# EAGLE schematic twomics_sw_led (EAGLE 7.7.0)
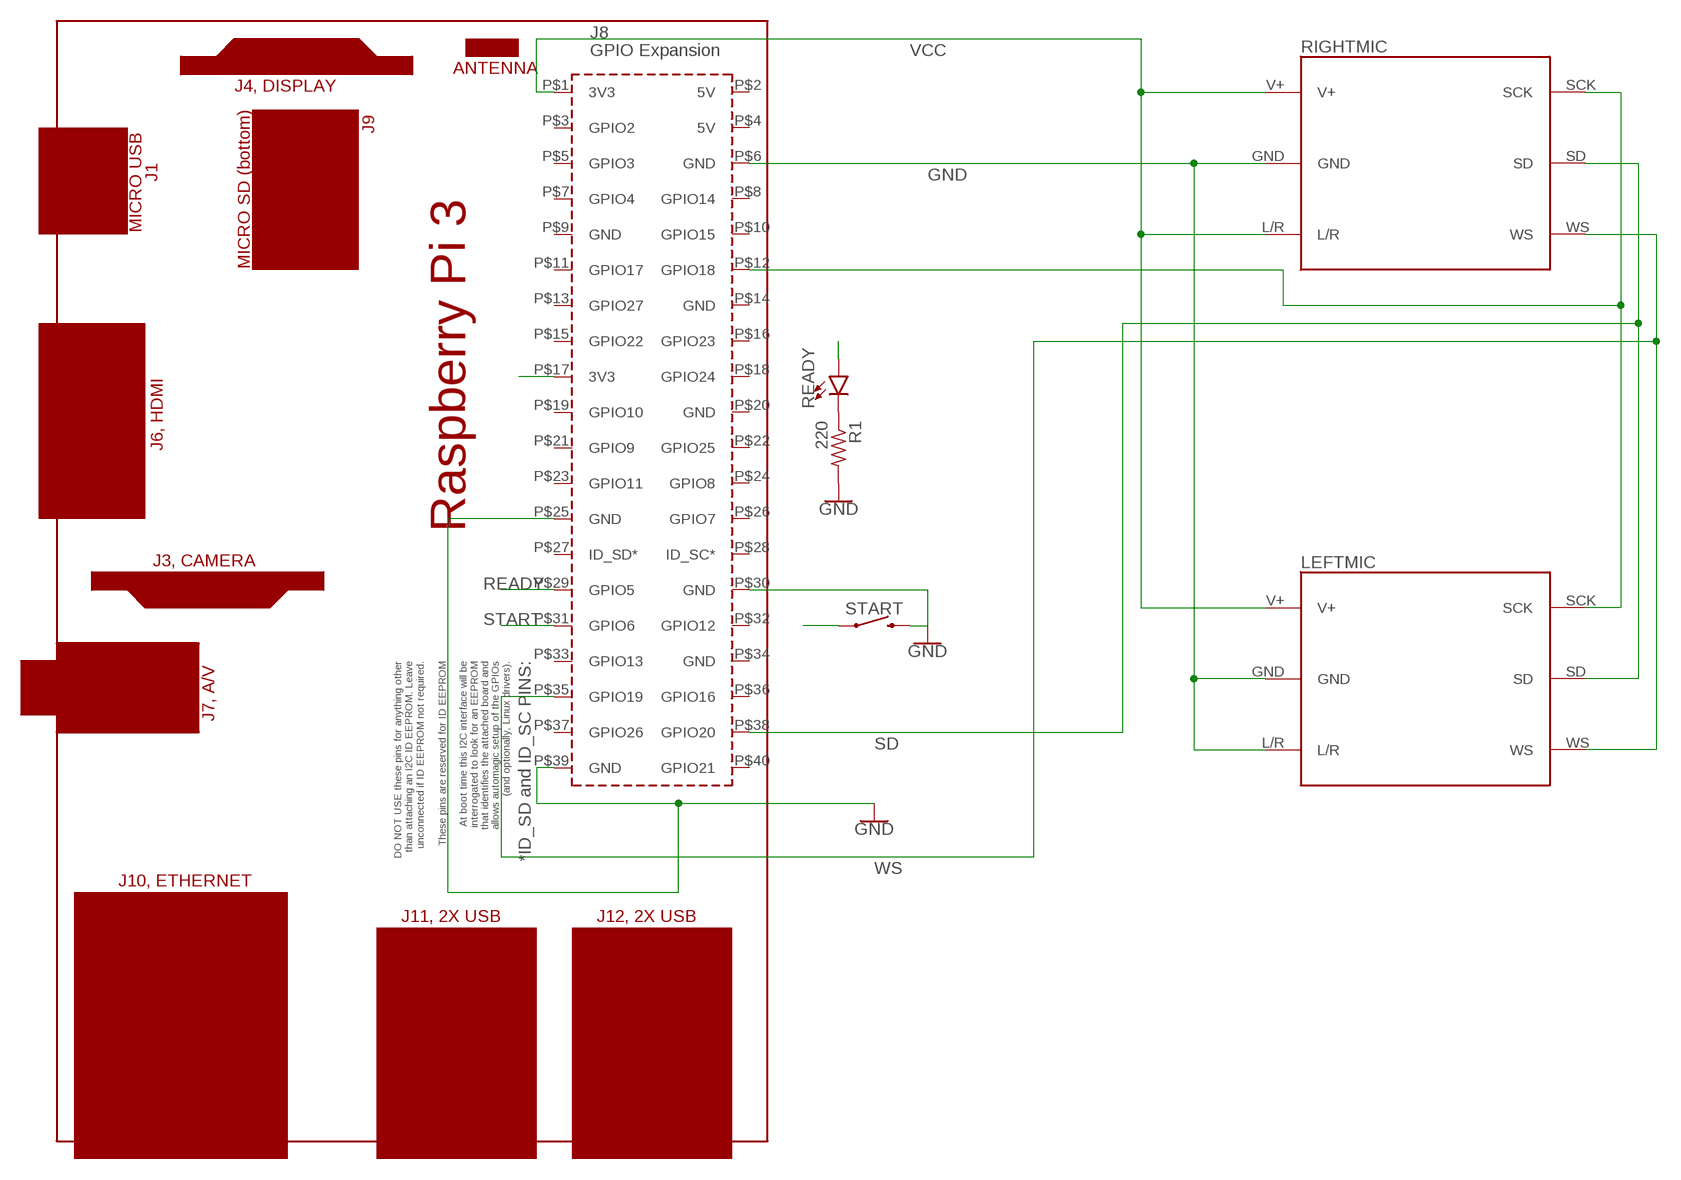
[diagram p0: schematic, sheet 1]

## Parts
LEFTMIC  EMMIC-ICS43432  [PTH]
PCB1  RPI3_40_PIN  [40_PIN]
R1  220  R-US_0207/7  [0207/7]
READY  LED3MM  [LED_3MM]
RIGHTMIC  EMMIC-ICS43432  [PTH]
START  MOMENTARY-SWITCH-SPST-PTH-6.0MM  [TACTILE_SWITCH_PTH_6.0MM]

## Nets
GND: LEFTMIC.GND LEFTMIC.L/R PCB1.P$6(GND) PCB1.P$25(GND) PCB1.P$30(GND) PCB1.P$39(GND) R1.2 RIGHTMIC.GND START.3
N$1: R1.1 READY.K(C)
READY: PCB1.P$29(GPIO5) READY.A
SCK: LEFTMIC.SCK PCB1.P$12(GPIO18) RIGHTMIC.SCK
SD: LEFTMIC.SD PCB1.P$38(GPIO20) RIGHTMIC.SD
START: PCB1.P$31(GPIO6) START.1
VCC: LEFTMIC.V+ PCB1.P$1(3V3) PCB1.P$17(3V3) RIGHTMIC.L/R RIGHTMIC.V+
WS: LEFTMIC.WS PCB1.P$35(GPIO19) RIGHTMIC.WS
Unconnected: PCB1.P$2(5V) PCB1.P$3(GPIO2) PCB1.P$4(5V) PCB1.P$5(GPIO3) PCB1.P$7(GPIO4) PCB1.P$8(GPIO14) PCB1.P$9(GND) PCB1.P$10(GPIO15) PCB1.P$11(GPIO17) PCB1.P$13(GPIO27) PCB1.P$14(GND) PCB1.P$15(GPIO22) PCB1.P$16(GPIO23) PCB1.P$18(GPIO24) PCB1.P$19(GPIO10) PCB1.P$20(GND) PCB1.P$21(GPIO9) PCB1.P$22(GPIO25) PCB1.P$23(GPIO11) PCB1.P$24(GPIO8) PCB1.P$26(GPIO7) PCB1.P$27(ID_SD*) PCB1.P$28(ID_SC*) PCB1.P$32(GPIO12) PCB1.P$33(GPIO13) PCB1.P$34(GND) PCB1.P$36(GPIO16) PCB1.P$37(GPIO26) PCB1.P$40(GPIO21)

## Library data of the parts
LEFTMIC RIGHTMIC = invensense:EMMIC-ICS43432
PCB1 = e14_Rpi3_RevA:RPI3_40_PIN: Device for Raspberry Pi 3 without an associated 40 pin header package created by Dave Young for www.element14.com.
R1 = resistor:R-US_: RESISTOR, American symbol
READY = SparkFun-LED:LED: LED (Generic) Standard schematic elements and footprints for 5mm, 3mm, 1206, and 0603 sized LEDs. Generic LEDs with no color specified.; PROD_ID: DIO-08794
START = SparkFun-Switches:MOMENTARY-SWITCH-SPST: Momentary Switch (Pushbutton) - SPST Normally-open (NO) SPST momentary switches (buttons, pushbuttons). Variants PTH-12MM - 12mm square, through-hole Momentary Pushbutton Switch - 12mm Square <https://www.sparkfun.com/products/9190> (COM-09190) PTH-6.0MM, PTH-6.0MM-KIT - 6.0mm square, through-hole Mini Pushbutton Switch <https://www.sparkfun.com/products/97> (COM-00097) KIT package intended for soldering kit's - only one side of pads' copper is exposed. PTH-RIGHT-ANGLE-KIT - Right-angle, through-hole Right Angle Tactile Button <https://www.sparkfun.com/products/10791> - Used on SparkFun BigTime Watch Kit <https://www.sparkfun.com/products/11734> SMD-12MM - 12mm square, surface-mount Tactile Button - SMD (12mm) <https://www.sparkfun.com/products/12993> (COM-12993) Used on SparkFun PicoBoard <https://www.sparkfun.com/products/11888> SMD-4.5MM - 4.5mm Square Trackball Switch Used on SparkFun Blackberry Trackballer Breakout <https://www.sparkfun.com/products/13169> SMD-4.6MMX2.8MM - 4.60mm x 2.80mm, surface mount Used on SparkFun SAMD21 Mini Breakout <https://www.sparkfun.com/products/13664> SMD-5.2MM, SMD-5.2-REDUNDANT - 5.2mm square, surface-mount Mini Pushbutton Switch - SMD <https://www.sparkfun.com/products/8720> (COM-08720) Used on Arduino Pro Mini <https://www.sparkfun.com/products/11114> REDUNDANT package connects both switch circuits together SMD-6.0X3.5MM - 6.0 x 3.5mm, surface mount Momentary Reset Switch SMD <https://www.sparkfun.com/products/8229> (COM-08229) SMD-6.2MM-TALL - 6.2mm square, surface mount Tactile Button - SMD (6mm) <https://www.sparkfun.com/products/12992> Used on SparkFun Digital Sandbox <https://www.sparkfun.com/products/12651> SMD-RIGHT-ANGLE - Right-angle, surface mount Used on SparkFun Block for Intel® Edison - Arduino <https://www.sparkfun.com/products/13036>; PROD_ID: SWCH-08441; SF_SKU: COM-00097